# EasyEDA schematic SCH_wordclocksmall_2023-02-03.json
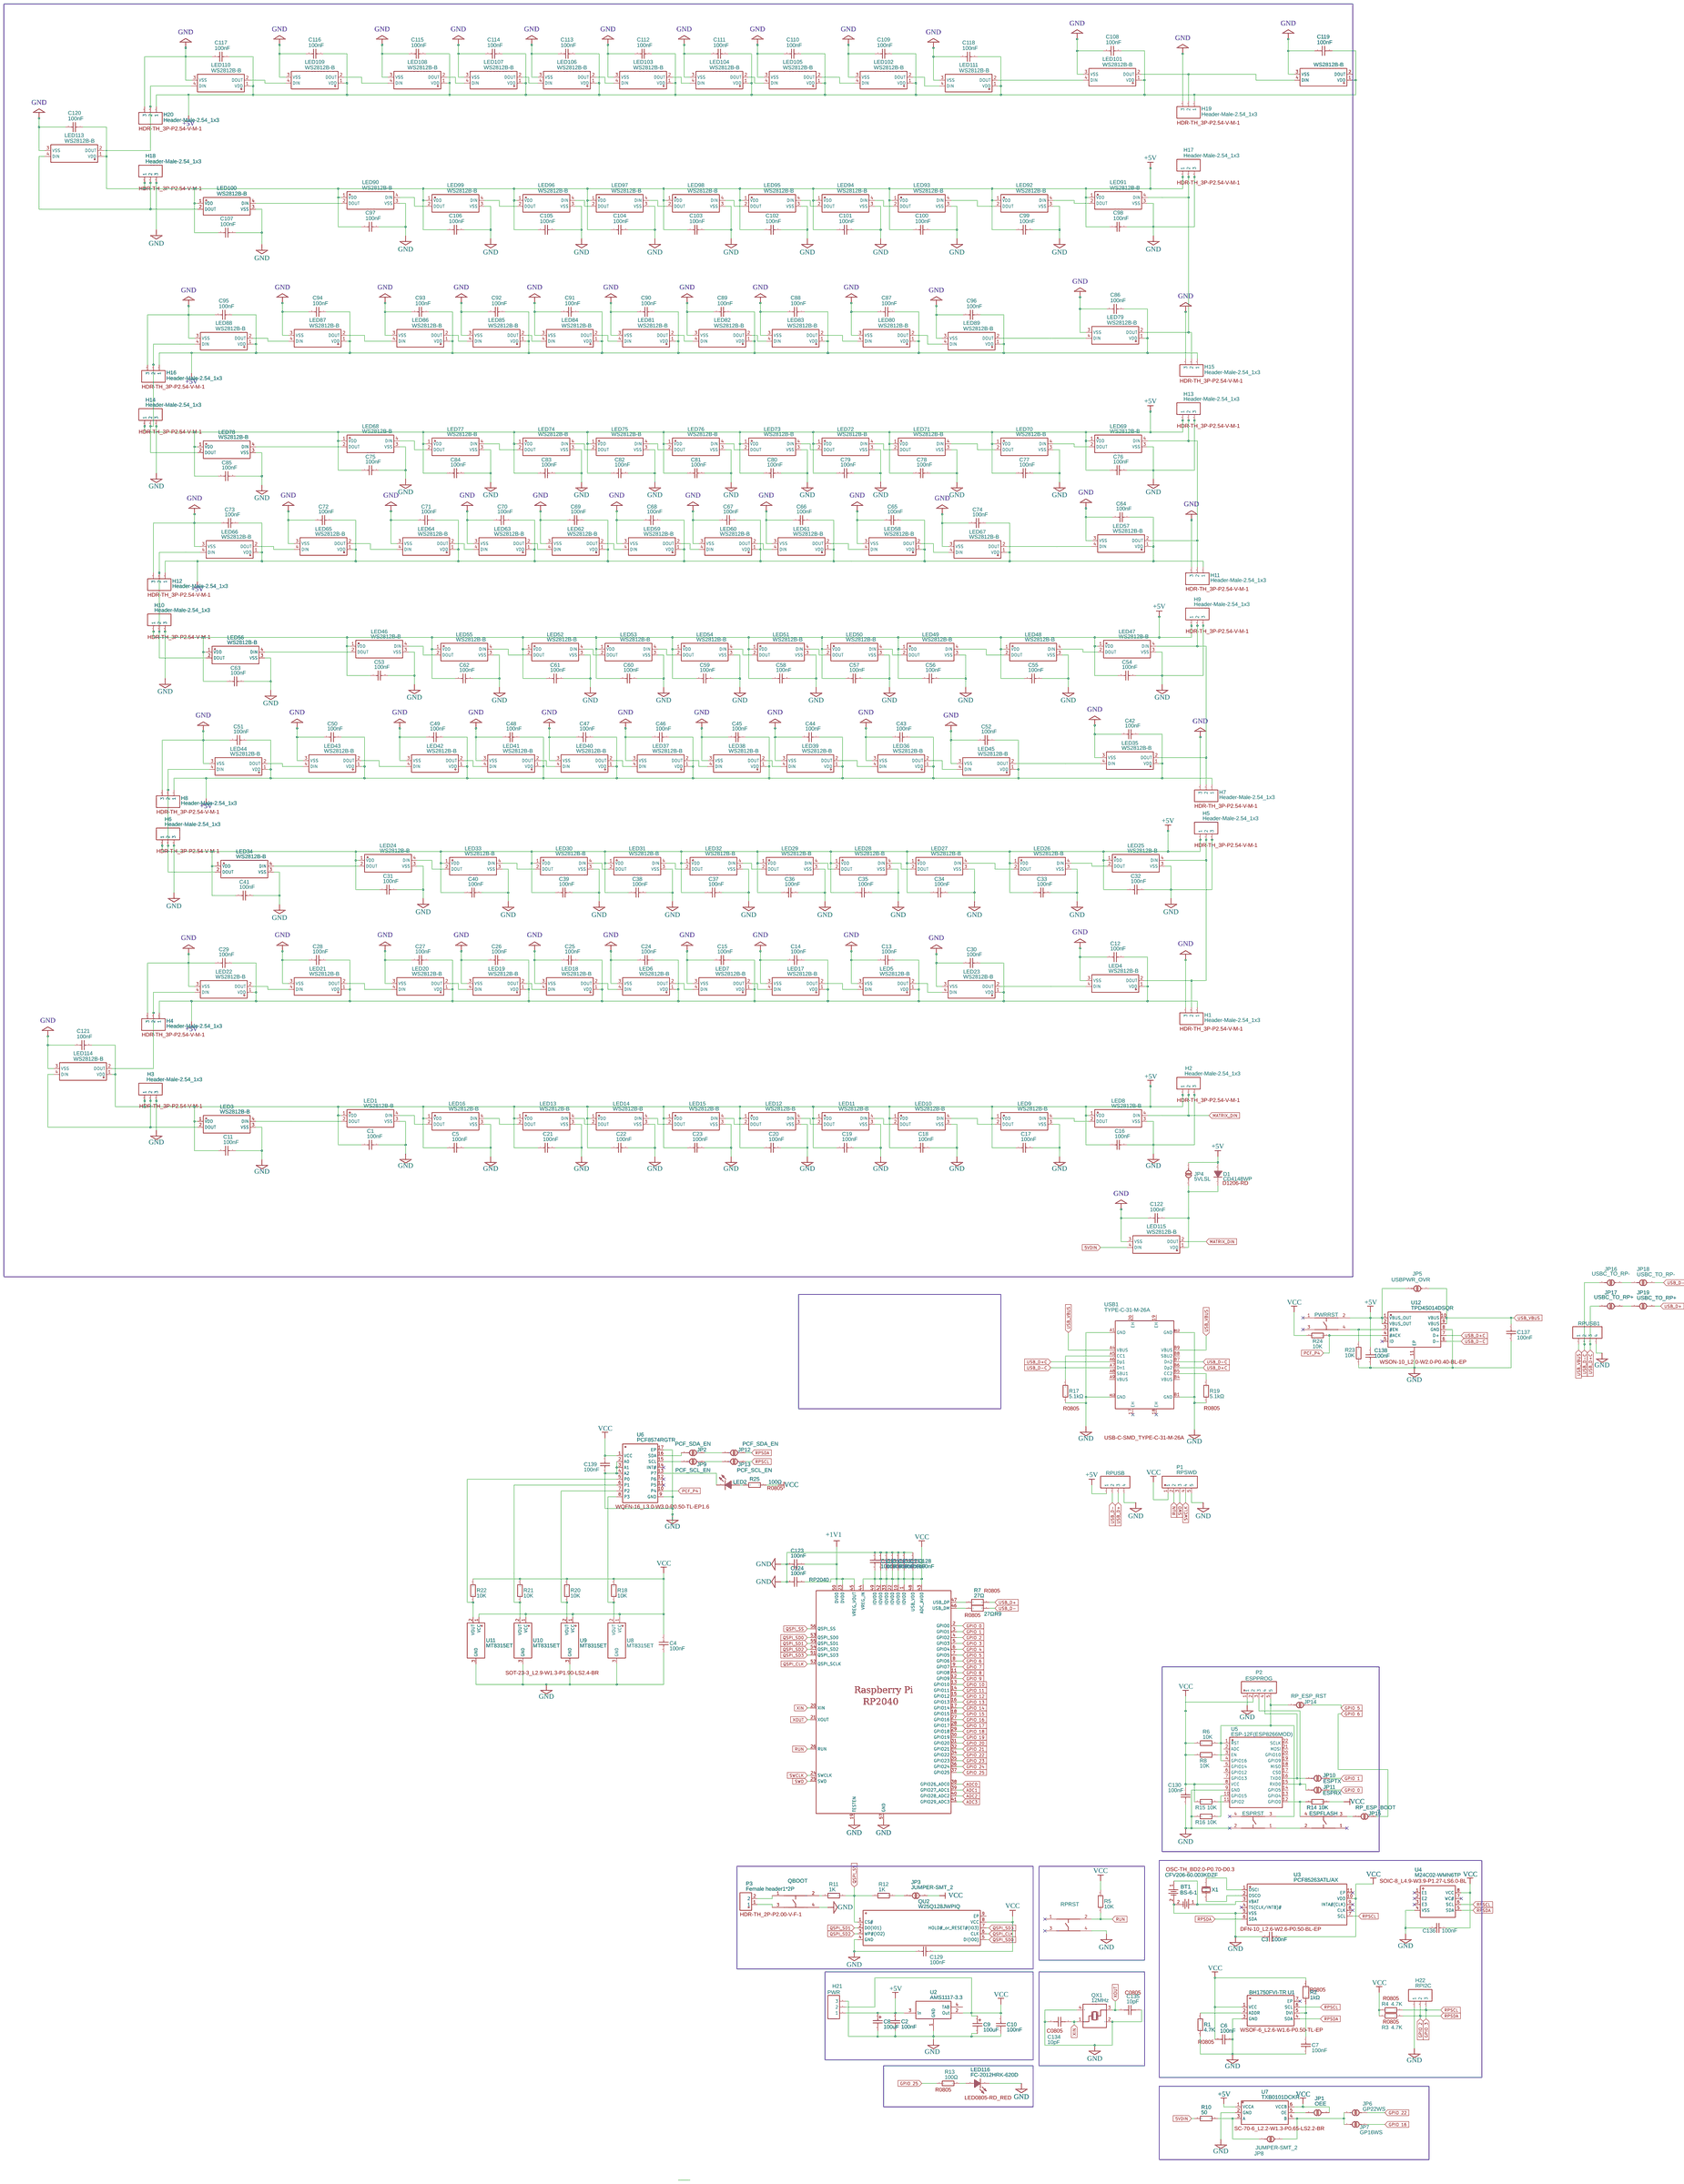
[diagram p0: schematic sheet]

## Parts
BT1  BS-6-1  [BAT-SMD_BS-6-1]
BT2  BS-6-1  [BAT-SMD_BS-6-1]
C1  100nF  [0805]
C2  100nF  [0805]
C3  100nF  [0805]
C4  100nF  [0805]
C5  100nF  [0805]
C6  100nF  [0805]
C7  100nF  [0805]
C8  100uF  [CAP-SMD_L3.5-W2.8]
C9  100uF  [CAP-SMD_L3.5-W2.8]
C10  100nF  [0805]
C11  100nF  [0805]
C12  100nF  [0805]
C13  100nF  [0805]
C14  100nF  [0805]
C15  100nF  [0805]
C16  100nF  [0805]
C17  100nF  [0805]
C18  100nF  [0805]
C19  100nF  [0805]
C20  100nF  [0805]
C21  100nF  [0805]
C22  100nF  [0805]
C23  100nF  [0805]
C24  100nF  [0805]
C25  100nF  [0805]
C26  100nF  [0805]
C27  100nF  [0805]
C28  100nF  [0805]
C29  100nF  [0805]
C30  100nF  [0805]
C31  100nF  [0805]
C32  100nF  [0805]
C33  100nF  [0805]
C34  100nF  [0805]
C35  100nF  [0805]
C36  100nF  [0805]
C37  100nF  [0805]
C38  100nF  [0805]
C39  100nF  [0805]
C40  100nF  [0805]
C41  100nF  [0805]
C42  100nF  [0805]
C43  100nF  [0805]
C44  100nF  [0805]
C45  100nF  [0805]
C46  100nF  [0805]
C47  100nF  [0805]
C48  100nF  [0805]
C49  100nF  [0805]
C50  100nF  [0805]
C51  100nF  [0805]
C52  100nF  [0805]
C53  100nF  [0805]
C54  100nF  [0805]
C55  100nF  [0805]
C56  100nF  [0805]
C57  100nF  [0805]
C58  100nF  [0805]
C59  100nF  [0805]
C60  100nF  [0805]
C61  100nF  [0805]
C62  100nF  [0805]
C63  100nF  [0805]
C64  100nF  [0805]
C65  100nF  [0805]
C66  100nF  [0805]
C67  100nF  [0805]
C68  100nF  [0805]
C69  100nF  [0805]
C70  100nF  [0805]
C71  100nF  [0805]
C72  100nF  [0805]
C73  100nF  [0805]
C74  100nF  [0805]
C75  100nF  [0805]
C76  100nF  [0805]
C77  100nF  [0805]
C78  100nF  [0805]
C79  100nF  [0805]
C80  100nF  [0805]
C81  100nF  [0805]
C82  100nF  [0805]
C83  100nF  [0805]
C84  100nF  [0805]
C85  100nF  [0805]
C86  100nF  [0805]
C87  100nF  [0805]
C88  100nF  [0805]
C89  100nF  [0805]
C90  100nF  [0805]
C91  100nF  [0805]
C92  100nF  [0805]
C93  100nF  [0805]
C94  100nF  [0805]
C95  100nF  [0805]
C96  100nF  [0805]
C97  100nF  [0805]
C98  100nF  [0805]
C99  100nF  [0805]
C100  100nF  [0805]
C101  100nF  [0805]
C102  100nF  [0805]
C103  100nF  [0805]
C104  100nF  [0805]
C105  100nF  [0805]
C106  100nF  [0805]
C107  100nF  [0805]
C108  100nF  [0805]
C109  100nF  [0805]
C110  100nF  [0805]
C111  100nF  [0805]
C112  100nF  [0805]
C113  100nF  [0805]
C114  100nF  [0805]
C115  100nF  [0805]
C116  100nF  [0805]
C117  100nF  [0805]
C118  100nF  [0805]
C119  100nF  [0805]
C120  100nF  [0805]
C121  100nF  [0805]
C122  100nF  [0805]
C123  100nF  [0805]
C124  100nF  [0805]
C125  100nF  [0805]
C126  100nF  [0805]
C127  100nF  [0805]
C128  100nF  [0805]
C129  100nF  [0805]
C130  100nF  [0805]
C131  100nF  [0805]
C132  100nF  [0805]
C133  100nF  [0805]
C134  10pF  [C0805]
C135  10pF  [C0805]
C136  100nF  [0805]
C137  100nF  [0805]
C138  100nF  [0805]
C139  100nF  [0805]
D1  CD4148WP  [D1206-RD]
ESPFLASH  PTS810SJM250SMTRLFS  [KEY-SMD_4P-L4.2-W3.2-P2.20-LS4.6]
ESPRST  PTS810SJM250SMTRLFS  [KEY-SMD_4P-L4.2-W3.2-P2.20-LS4.6]
H1  Header-Male-2.54_1x3  [HDR-TH_3P-P2.54-V-M-1]
H2  Header-Male-2.54_1x3  [HDR-TH_3P-P2.54-V-M-1]
H3  Header-Male-2.54_1x3  [HDR-TH_3P-P2.54-V-M-1]
H4  Header-Male-2.54_1x3  [HDR-TH_3P-P2.54-V-M-1]
H5  Header-Male-2.54_1x3  [HDR-TH_3P-P2.54-V-M-1]
H6  Header-Male-2.54_1x3  [HDR-TH_3P-P2.54-V-M-1]
H7  Header-Male-2.54_1x3  [HDR-TH_3P-P2.54-V-M-1]
H8  Header-Male-2.54_1x3  [HDR-TH_3P-P2.54-V-M-1]
H9  Header-Male-2.54_1x3  [HDR-TH_3P-P2.54-V-M-1]
H10  Header-Male-2.54_1x3  [HDR-TH_3P-P2.54-V-M-1]
H11  Header-Male-2.54_1x3  [HDR-TH_3P-P2.54-V-M-1]
H12  Header-Male-2.54_1x3  [HDR-TH_3P-P2.54-V-M-1]
H13  Header-Male-2.54_1x3  [HDR-TH_3P-P2.54-V-M-1]
H14  Header-Male-2.54_1x3  [HDR-TH_3P-P2.54-V-M-1]
H15  Header-Male-2.54_1x3  [HDR-TH_3P-P2.54-V-M-1]
H16  Header-Male-2.54_1x3  [HDR-TH_3P-P2.54-V-M-1]
H17  Header-Male-2.54_1x3  [HDR-TH_3P-P2.54-V-M-1]
H18  Header-Male-2.54_1x3  [HDR-TH_3P-P2.54-V-M-1]
H19  Header-Male-2.54_1x3  [HDR-TH_3P-P2.54-V-M-1]
H20  Header-Male-2.54_1x3  [HDR-TH_3P-P2.54-V-M-1]
H21  PWR  [HDR-TH_3P-P2.54-V-M-1]
H22  RPI2C  [HDR-TH_3P-P2.54-V-M-1]
JP1  OEE  [JUMPERS_SMT-JUMPER_2_NC_PASTE_NO-SILK]
JP2  PCF_SDA_EN  [JUMPERS_SMT-JUMPER_2_NC_PASTE_NO-SILK]
JP3  JUMPER-SMT_2  [JUMPERS_SMT-JUMPER_2_NC_PASTE_NO-SILK]
JP4  5VLSL  [JUMPERS_SMT-JUMPER_2_NC_PASTE_NO-SILK]
JP5  USBPWR_OVR  [JUMPERS_SMT-JUMPER_2_NC_PASTE_NO-SILK]
JP6  GP22WS  [JUMPERS_SMT-JUMPER_2_NC_PASTE_NO-SILK]
JP7  GP16WS  [JUMPERS_SMT-JUMPER_2_NC_PASTE_NO-SILK]
JP8  JUMPER-SMT_2  [JUMPERS_SMT-JUMPER_2_NC_PASTE_NO-SILK]
JP9  PCF_SCL_EN  [JUMPERS_SMT-JUMPER_2_NC_PASTE_NO-SILK]
JP10  ESPTX  [JUMPERS_SMT-JUMPER_2_NC_PASTE_NO-SILK]
JP11  ESPRX  [JUMPERS_SMT-JUMPER_2_NC_PASTE_NO-SILK]
JP12  PCF_SDA_EN  [JUMPERS_SMT-JUMPER_2_NC_PASTE_NO-SILK]
JP13  PCF_SCL_EN  [JUMPERS_SMT-JUMPER_2_NC_PASTE_NO-SILK]
JP14  RP_ESP_RST  [JUMPERS_SMT-JUMPER_2_NC_PASTE_NO-SILK]
JP15  RP_ESP_BOOT  [JUMPERS_SMT-JUMPER_2_NC_PASTE_NO-SILK]
JP16  USBC_TO_RP-  [JUMPERS_SMT-JUMPER_2_NC_PASTE_NO-SILK]
JP17  USBC_TO_RP+  [JUMPERS_SMT-JUMPER_2_NC_PASTE_NO-SILK]
JP18  USBC_TO_RP-  [JUMPERS_SMT-JUMPER_2_NC_PASTE_NO-SILK]
JP19  USBC_TO_RP+  [JUMPERS_SMT-JUMPER_2_NC_PASTE_NO-SILK]
LED1  WS2812B-B  [LED-5050_4P]
LED2  FC-2012HRK-620D  [LED0805-RD_RED]
LED3  WS2812B-B  [LED-5050_4P]
LED4  WS2812B-B  [LED-5050_4P]
LED5  WS2812B-B  [LED-5050_4P]
LED6  WS2812B-B  [LED-5050_4P]
LED7  WS2812B-B  [LED-5050_4P]
LED8  WS2812B-B  [LED-5050_4P]
LED9  WS2812B-B  [LED-5050_4P]
LED10  WS2812B-B  [LED-5050_4P]
LED11  WS2812B-B  [LED-5050_4P]
LED12  WS2812B-B  [LED-5050_4P]
LED13  WS2812B-B  [LED-5050_4P]
LED14  WS2812B-B  [LED-5050_4P]
LED15  WS2812B-B  [LED-5050_4P]
LED16  WS2812B-B  [LED-5050_4P]
LED17  WS2812B-B  [LED-5050_4P]
LED18  WS2812B-B  [LED-5050_4P]
LED19  WS2812B-B  [LED-5050_4P]
LED20  WS2812B-B  [LED-5050_4P]
LED21  WS2812B-B  [LED-5050_4P]
LED22  WS2812B-B  [LED-5050_4P]
LED23  WS2812B-B  [LED-5050_4P]
LED24  WS2812B-B  [LED-5050_4P]
LED25  WS2812B-B  [LED-5050_4P]
LED26  WS2812B-B  [LED-5050_4P]
LED27  WS2812B-B  [LED-5050_4P]
LED28  WS2812B-B  [LED-5050_4P]
LED29  WS2812B-B  [LED-5050_4P]
LED30  WS2812B-B  [LED-5050_4P]
LED31  WS2812B-B  [LED-5050_4P]
LED32  WS2812B-B  [LED-5050_4P]
LED33  WS2812B-B  [LED-5050_4P]
LED34  WS2812B-B  [LED-5050_4P]
LED35  WS2812B-B  [LED-5050_4P]
LED36  WS2812B-B  [LED-5050_4P]
LED37  WS2812B-B  [LED-5050_4P]
LED38  WS2812B-B  [LED-5050_4P]
LED39  WS2812B-B  [LED-5050_4P]
LED40  WS2812B-B  [LED-5050_4P]
LED41  WS2812B-B  [LED-5050_4P]
LED42  WS2812B-B  [LED-5050_4P]
LED43  WS2812B-B  [LED-5050_4P]
LED44  WS2812B-B  [LED-5050_4P]
LED45  WS2812B-B  [LED-5050_4P]
LED46  WS2812B-B  [LED-5050_4P]
LED47  WS2812B-B  [LED-5050_4P]
LED48  WS2812B-B  [LED-5050_4P]
LED49  WS2812B-B  [LED-5050_4P]
LED50  WS2812B-B  [LED-5050_4P]
LED51  WS2812B-B  [LED-5050_4P]
LED52  WS2812B-B  [LED-5050_4P]
LED53  WS2812B-B  [LED-5050_4P]
LED54  WS2812B-B  [LED-5050_4P]
LED55  WS2812B-B  [LED-5050_4P]
LED56  WS2812B-B  [LED-5050_4P]
LED57  WS2812B-B  [LED-5050_4P]
LED58  WS2812B-B  [LED-5050_4P]
LED59  WS2812B-B  [LED-5050_4P]
LED60  WS2812B-B  [LED-5050_4P]
LED61  WS2812B-B  [LED-5050_4P]
LED62  WS2812B-B  [LED-5050_4P]
LED63  WS2812B-B  [LED-5050_4P]
LED64  WS2812B-B  [LED-5050_4P]
LED65  WS2812B-B  [LED-5050_4P]
LED66  WS2812B-B  [LED-5050_4P]
LED67  WS2812B-B  [LED-5050_4P]
LED68  WS2812B-B  [LED-5050_4P]
LED69  WS2812B-B  [LED-5050_4P]
LED70  WS2812B-B  [LED-5050_4P]
LED71  WS2812B-B  [LED-5050_4P]
LED72  WS2812B-B  [LED-5050_4P]
LED73  WS2812B-B  [LED-5050_4P]
LED74  WS2812B-B  [LED-5050_4P]
LED75  WS2812B-B  [LED-5050_4P]
LED76  WS2812B-B  [LED-5050_4P]
LED77  WS2812B-B  [LED-5050_4P]
LED78  WS2812B-B  [LED-5050_4P]
LED79  WS2812B-B  [LED-5050_4P]
LED80  WS2812B-B  [LED-5050_4P]
LED81  WS2812B-B  [LED-5050_4P]
LED82  WS2812B-B  [LED-5050_4P]
LED83  WS2812B-B  [LED-5050_4P]
LED84  WS2812B-B  [LED-5050_4P]
LED85  WS2812B-B  [LED-5050_4P]
LED86  WS2812B-B  [LED-5050_4P]
LED87  WS2812B-B  [LED-5050_4P]
LED88  WS2812B-B  [LED-5050_4P]
LED89  WS2812B-B  [LED-5050_4P]
LED90  WS2812B-B  [LED-5050_4P]
LED91  WS2812B-B  [LED-5050_4P]
LED92  WS2812B-B  [LED-5050_4P]
LED93  WS2812B-B  [LED-5050_4P]
LED94  WS2812B-B  [LED-5050_4P]
LED95  WS2812B-B  [LED-5050_4P]
LED96  WS2812B-B  [LED-5050_4P]
LED97  WS2812B-B  [LED-5050_4P]
LED98  WS2812B-B  [LED-5050_4P]
LED99  WS2812B-B  [LED-5050_4P]
LED100  WS2812B-B  [LED-5050_4P]
LED101  WS2812B-B  [LED-5050_4P]
LED102  WS2812B-B  [LED-5050_4P]
LED103  WS2812B-B  [LED-5050_4P]
LED104  WS2812B-B  [LED-5050_4P]
LED105  WS2812B-B  [LED-5050_4P]
LED106  WS2812B-B  [LED-5050_4P]
LED107  WS2812B-B  [LED-5050_4P]
LED108  WS2812B-B  [LED-5050_4P]
LED109  WS2812B-B  [LED-5050_4P]
LED110  WS2812B-B  [LED-5050_4P]
LED111  WS2812B-B  [LED-5050_4P]
LED112  WS2812B-B  [LED-5050_4P]
LED113  WS2812B-B  [LED-5050_4P]
LED114  WS2812B-B  [LED-5050_4P]
LED115  WS2812B-B  [LED-5050_4P]
LED116  FC-2012HRK-620D  [LED0805-RD_RED]
P1  RPSWD  [HDR-TH_5P-P2.00-V-F-1]
P2  ESPPROG  [HDR-TH_5P-P2.00-V-F-1]
P3  Female header1*2P  [HDR-TH_2P-P2.00-V-F-1]
PWRRST  PTS810SJM250SMTRLFS  [KEY-SMD_4P-L4.2-W3.2-P2.20-LS4.6]
QBOOT  PTS810SJM250SMTRLFS  [KEY-SMD_4P-L4.2-W3.2-P2.20-LS4.6]
QU1  RP2040  [LQFN-56_L7.0-W7.0-P0.4-EP]
QU2  W25Q128JWPIQ  [WSON-8_L6.0-W5.0-P1.27-BL-EP]
QX1  12MHz  [CRYSTAL-SMD_4P-L3.2-W2.5-BL]
R1  4.7K  [R0805]
R2  1kΩ  [R0805]
R3  4.7K  [R0805]
R4  4.7K  [R0805]
R5  10K  [0805]
R6  10K  [0805]
R7  27Ω  [R0805]
R8  10K  [0805]
R9  27Ω  [R0805]
R10  50  [0805]
R11  1K  [0805]
R12  1K  [0805]
R13  100Ω  [R0805]
R14  10K  [0805]
R15  10K  [0805]
R16  10K  [0805]
R17  5.1kΩ  [R0805]
R18  10K  [0805]
R19  5.1kΩ  [R0805]
R20  10K  [0805]
R21  10K  [0805]
R22  10K  [0805]
R23  10K  [0805]
R24  10K  [0805]
R25  100Ω  [R0805]
RPRST  PTS810SJM250SMTRLFS  [KEY-SMD_4P-L4.2-W3.2-P2.20-LS4.6]
RPUSB  HDR-M-2.54_1x4  [HDR-M-2.54_1X4]
RPUSB1  HDR-M-2.54_1x4  [HDR-M-2.54_1X4]
U1  BH1750FVI-TR  [WSOF-6_L2.6-W1.6-P0.50-TL-EP]
U2  AMS1117-3.3  [SOT-223_L6.5-W3.5-P2.30-LS7.0-BR]
U3  PCF85263ATL/AX  [DFN-10_L2.6-W2.6-P0.50-BL-EP]
U4  M24C02-WMN6TP  [SOIC-8_L4.9-W3.9-P1.27-LS6.0-BL]
U5  ESP-12F(ESP8266MOD)  [WIFIM-SMD_ESP-12F-ESP8266MOD]
U6  PCF8574RGTR  [WQFN-16_L3.0-W3.0-P0.50-TL-EP1.6]
U7  TXB0101DCKR  [SC-70-6_L2.2-W1.3-P0.65-LS2.2-BR]
U8  MT8315ET  [SOT-23-3_L2.9-W1.3-P1.90-LS2.4-BR]
U9  MT8315ET  [SOT-23-3_L2.9-W1.3-P1.90-LS2.4-BR]
U10  MT8315ET  [SOT-23-3_L2.9-W1.3-P1.90-LS2.4-BR]
U11  MT8315ET  [SOT-23-3_L2.9-W1.3-P1.90-LS2.4-BR]
U12  TPD4S014DSQR  [WSON-10_L2.0-W2.0-P0.40-BL-EP]
USB1  TYPE-C-31-M-26A  [USB-C-SMD_TYPE-C-31-M-26A]
X1  CFV206-60.003KDZF  [OSC-TH_BD2.0-P0.70-D0.3]

## Library data of the parts
BT1 BT2 = BS-6-1: Supplier: LCSC; Supplier Part: C969909; Manufacturer: Q&J; Contributor: LCSC; JLCPCB Part Class: Extended Part; Package Display: No
C1-C7 C10-C133 C136-C139 = CC0805KRX7R9BB104: Supplier: LCSC; Manufacturer: YAGEO; LCSC Assembly: Yes; Supplier Part: C49678; SMT Type: Basic
C8 C9 = TAJB107K006RNJ: Supplier: LCSC; Manufacturer: AVX; LCSC Assembly: Yes; Supplier Part: C16133; SMT Type: Basic
C134 = CC0805JRNPOYBN100: Supplier: LCSC; Supplier Part: C1785; Manufacturer: YAGEO; Manufacturer Part: CL21C100JBANNNC; Contributor: LCSC; JLCPCB Part Class: Extended Part; Package Display: Yes
C135 = CC0805JRNPOYBN100: Supplier: LCSC; Supplier Part: C1785; Manufacturer: YAGEO; Manufacturer Part: CL21C100JBANNNC; Contributor: LCSC; JLCPCB Part Class: Basic Part; Package Display: Yes
D1 = CD4148WP: Supplier: LCSC; Manufacturer: LIZ; Supplier Part: C109000; JLCPCB Part Class: Extended Part; Package Display: Yes
ESPFLASH ESPRST PWRRST QBOOT RPRST = PTS810SJM250SMTRLFS: Supplier: LCSC; Supplier Part: C116501; Manufacturer: C&K; Contributor: LCSC; JLCPCB Part Class: Extended Part
H1-H20 = Header-Male-2.54_1x3: Supplier: LCSC; Manufacturer: BOOMELE; Manufacturer Part: Header2.54mm 1*3P; Supplier Part: C49257; JLCPCB Part Class: Extended Part; Package Display: Yes
H21 H22 = Header-Male-2.54_1x3: Supplier: LCSC; Manufacturer: BOOMELE; Manufacturer Part: Header2.54mm 1*3P; Supplier Part: C49257; JLCPCB Part Class: Extended Part; Package Display: No
JP1-JP19 = JUMPER-SMT_2: Contributor: Celeron; Package Display: No
LED1 LED3-LED115 = -: Supplier: LCSC; Manufacturer: Worldsemi; Contributor: LCSC; Supplier Part: C114586
LED2 = FC-2012HRK-620D: Supplier: LCSC; Manufacturer: NATIONSTAR; Supplier Part: C84256; JLCPCB Part Class: Basic Part; Package Display: No
LED116 = FC-2012HRK-620D: Supplier: LCSC; Manufacturer: NATIONSTAR; Supplier Part: C84256; JLCPCB Part Class: Basic Part; Package Display: Yes
P1 P2 = Female header1*5P: Supplier: LCSC; Manufacturer: BOOMELE; Supplier Part: C66508; JLCPCB Part Class: Extended Part; Package Display: No
P3 = Female header1*2P: Supplier: LCSC; Manufacturer: BOOMELE; Supplier Part: C66509; JLCPCB Part Class: Extended Part; Package Display: Yes
QU1 = RP2040: Supplier: LCSC; Supplier Part: C2040; Manufacturer: Raspberry Pi(树莓派); JLCPCB Part Class: Extended Part; Contributor: LCSC
QU2 = W25Q128JWPIQ: Supplier: LCSC; Supplier Part: C2689660; Manufacturer: WINBOND(华邦); Contributor: LCSC; JLCPCB Part Class: Extended Part
QX1 = SMD-3225_4P12M12PF10PPM: Supplier: LCSC; Manufacturer: YXC; Manufacturer Part: X322512MSB4SI; Contributor: LCSC; Supplier Part: C9002; JLCPCB Part Class: Basic Part
R1 R3 R4 = CR0805F4K7P05: Supplier: LCSC; Supplier Part: C17673; Manufacturer: UniOhm; Manufacturer Part: 0805W8F4701T5E; Contributor: LCSC; JLCPCB Part Class: Basic Part; Package Display: Yes
R2 = PTFR0805D1K00P9: Supplier: LCSC; Supplier Part: C17513; Manufacturer: UniOhm; Manufacturer Part: 0805W8F1001T5E; Resistance (Ohms): 1K; Contributor: LCSC; JLCPCB Part Class: Basic Part; Package Display: Yes
R5 R6 R8 R10 R14-R16 R18 R20-R24 = 0805W8F1002T5E: Supplier: LCSC; Manufacturer: UniOhm; LCSC Assembly: Yes; Supplier Part: C17414; SMT Type: Basic
R7 R9 = CR0805F24RP05: Supplier: LCSC; Supplier Part: C17594; Manufacturer: Ever Ohms Tech; Manufacturer Part: 0805W8F270JT5E; Resistance (Ohms): 27; Contributor: LCSC; JLCPCB Part Class: Basic Part; Package Display: Yes
R11 R12 = 0805W8F1002T5E: Supplier: LCSC; Manufacturer: UniOhm; Manufacturer Part: 0805W8F1001T5E; LCSC Assembly: Yes; Supplier Part: C17513; SMT Type: Basic
R13 R25 = PTFR0805B100RN9: Supplier: LCSC; Supplier Part: C17408; Manufacturer: UniOhm; Manufacturer Part: 0805W8F1000T5E; Resistance (Ohms): 100; Contributor: LCSC; JLCPCB Part Class: Extended Part; Package Display: Yes
R17 R19 = 0805W8F5101T5E: Supplier: LCSC; Manufacturer: UNI-ROYAL(厚声); Supplier Part: C27834; Resistance (Ohms): 5.1K; JLCPCB Part Class: Basic Part; Package Display: Yes
RPUSB RPUSB1 = HDR-M-2.54_1x4: Supplier Part: C124378; Supplier: LCSC; Contributor: LCEDA_Lib
U1 = BH1750FVI-TR: Supplier: LCSC; Manufacturer: ROHM; Supplier Part: C78960; JLCPCB Part Class: Extended Part; Package Display: Yes
U2 = -: sourceId: dwIGgezVh; Supplier: LCSC; Manufacturer: AMS; LCSC Assembly: Yes; image: //image.lceda.cn/szlcsc/C6186.jpg; Supplier Part: C6186; SMT Type: Basic
U3 = PCF85263ATL/AX: Supplier: LCSC; Supplier Part: C2651523; Manufacturer: NXP(恩智浦); JLCPCB Part Class: Extended Part; Contributor: LCSC; Package Display: Yes
U4 = M24C02-WMN6TP: Supplier: LCSC; Manufacturer: ST(意法半导体); Supplier Part: C7562; JLCPCB Part Class: Basic Part; Package Display: Yes
U5 = ESP-12F(ESP8266MOD): Supplier: LCSC; Manufacturer: Ai-Thinker(安信可); Supplier Part: C82891; JLCPCB Part Class: Extended Part; Package Display: No
U6 = PCF8574RGTR: Supplier: LCSC; Supplier Part: C2652270; Manufacturer: TI(德州仪器); Contributor: LCSC; Package Display: Yes
U7 = TXB0101DCKR: Supplier: LCSC; Supplier Part: C324081; Manufacturer: Texas Instruments; Contributor: LCSC; JLCPCB Part Class: Extended Part; Package Display: Yes
U8 U9 U11 = MT8315ET: Supplier: LCSC; Supplier Part: C879584; Manufacturer: MagnTek(麦歌恩); Contributor: LCSC; JLCPCB Part Class: Extended Part; Package Display: No
U10 = MT8315ET: Supplier: LCSC; Supplier Part: C879584; Manufacturer: MagnTek(麦歌恩); Contributor: LCSC; JLCPCB Part Class: Extended Part; Package Display: Yes
U12 = TPD4S014DSQR: Supplier: LCSC; Supplier Part: C202244; Manufacturer: TI(德州仪器); Contributor: LCSC; JLCPCB Part Class: Extended Part; Package Display: Yes
USB1 = TYPE-C-31-M-26A: Supplier: LCSC; Supplier Part: C2848621; Manufacturer: 韩国韩荣; Contributor: LCSC; JLCPCB Part Class: Extended Part; Package Display: Yes
X1 = CFV206-60.003KDZF: Supplier: LCSC; Supplier Part: C389957; Manufacturer: CITIZEN; Contributor: LCSC; JLCPCB Part Class: Extended Part; Package Display: Yes

## Nets
5VDIN: LED115.4(DIN) R10.1
+1V1: C123.1 C124.1 QU1.23(DVDD) QU1.45(VREG_VOUT) QU1.50(DVDD)
+5V: C1.1 C2.2 C5.1 C8.1 C11.1 C12.1 C13.1 C14.1 C15.1 C16.1 C17.1 C18.1 C19.1 C20.1 C21.1 C22.1 C23.1 C24.1 C25.1 C26.1 C27.1 C28.1 C29.1 C30.1 C31.1 C32.1 C33.1 C34.1 C35.1 C36.1 C37.1 C38.1 C39.1 C40.1 C41.1 C42.1 C43.1 C44.1 C45.1 C46.1 C47.1 C48.1 C49.1 C50.1 C51.1 C52.1 C53.1 C54.1 C55.1 C56.1 C57.1 C58.1 C59.1 C60.1 C61.1 C62.1 C63.1 C64.1 C65.1 C66.1 C67.1 C68.1 C69.1 C70.1 C71.1 C72.1 C73.1 C74.1 C75.1 C76.1 C77.1 C78.1 C79.1 C80.1 C81.1 C82.1 C83.1 C84.1 C85.1 C86.1 C87.1 C88.1 C89.1 C90.1 C91.1 C92.1 C93.1 C94.1 C95.1 C96.1 C97.1 C98.1 C99.1 C100.1 C101.1 C102.1 C103.1 C104.1 C105.1 C106.1 C107.1 C108.1 C109.1 C110.1 C111.1 C112.1 C113.1 C114.1 C115.1 C116.1 C117.1 C118.1 C119.1 C120.1 C121.1 C138.1 D1.2(A) H1.1 H2.1 H3.1 H4.1 H5.1 H6.1 H7.1 H8.1 H9.1 H10.1 H11.1 H12.1 H13.1 H14.1 H15.1 H16.1 H17.1 H18.1 H19.1 H20.1 H21.1 JP4.1 JP5.1 LED1.1(VDD) LED3.1(VDD) LED4.1(VDD) LED5.1(VDD) LED6.1(VDD) LED7.1(VDD) LED8.1(VDD) LED9.1(VDD) LED10.1(VDD) LED11.1(VDD) LED12.1(VDD) LED13.1(VDD) LED14.1(VDD) LED15.1(VDD) LED16.1(VDD) LED17.1(VDD) LED18.1(VDD) LED19.1(VDD) LED20.1(VDD) LED21.1(VDD) LED22.1(VDD) LED23.1(VDD) LED24.1(VDD) LED25.1(VDD) LED26.1(VDD) LED27.1(VDD) LED28.1(VDD) LED29.1(VDD) LED30.1(VDD) LED31.1(VDD) LED32.1(VDD) LED33.1(VDD) LED34.1(VDD) LED35.1(VDD) LED36.1(VDD) LED37.1(VDD) LED38.1(VDD) LED39.1(VDD) LED40.1(VDD) LED41.1(VDD) LED42.1(VDD) LED43.1(VDD) LED44.1(VDD) LED45.1(VDD) LED46.1(VDD) LED47.1(VDD) LED48.1(VDD) LED49.1(VDD) LED50.1(VDD) LED51.1(VDD) LED52.1(VDD) LED53.1(VDD) LED54.1(VDD) LED55.1(VDD) LED56.1(VDD) LED57.1(VDD) LED58.1(VDD) LED59.1(VDD) LED60.1(VDD) LED61.1(VDD) LED62.1(VDD) LED63.1(VDD) LED64.1(VDD) LED65.1(VDD) LED66.1(VDD) LED67.1(VDD) LED68.1(VDD) LED69.1(VDD) LED70.1(VDD) LED71.1(VDD) LED72.1(VDD) LED73.1(VDD) LED74.1(VDD) LED75.1(VDD) LED76.1(VDD) LED77.1(VDD) LED78.1(VDD) LED79.1(VDD) LED80.1(VDD) LED81.1(VDD) LED82.1(VDD) LED83.1(VDD) LED84.1(VDD) LED85.1(VDD) LED86.1(VDD) LED87.1(VDD) LED88.1(VDD) LED89.1(VDD) LED90.1(VDD) LED91.1(VDD) LED92.1(VDD) LED93.1(VDD) LED94.1(VDD) LED95.1(VDD) LED96.1(VDD) LED97.1(VDD) LED98.1(VDD) LED99.1(VDD) LED100.1(VDD) LED101.1(VDD) LED102.1(VDD) LED103.1(VDD) LED104.1(VDD) LED105.1(VDD) LED106.1(VDD) LED107.1(VDD) LED108.1(VDD) LED109.1(VDD) LED110.1(VDD) LED111.1(VDD) LED112.1(VDD) LED113.1(VDD) LED114.1(VDD) PWRRST.2 RPUSB.1 U2.3(In) U7.1(VCCA) U12.1(VBUS_OUT) U12.2(VBUS_OUT)
GND: BT1.2 BT2.2 C1.2 C2.1 C3.2 C4.2 C5.2 C6.1 C7.2 C8.2 C9.2 C10.1 C11.2 C12.2 C13.2 C14.2 C15.2 C16.2 C17.2 C18.2 C19.2 C20.2 C21.2 C22.2 C23.2 C24.2 C25.2 C26.2 C27.2 C28.2 C29.2 C30.2 C31.2 C32.2 C33.2 C34.2 C35.2 C36.2 C37.2 C38.2 C39.2 C40.2 C41.2 C42.2 C43.2 C44.2 C45.2 C46.2 C47.2 C48.2 C49.2 C50.2 C51.2 C52.2 C53.2 C54.2 C55.2 C56.2 C57.2 C58.2 C59.2 C60.2 C61.2 C62.2 C63.2 C64.2 C65.2 C66.2 C67.2 C68.2 C69.2 C70.2 C71.2 C72.2 C73.2 C74.2 C75.2 C76.2 C77.2 C78.2 C79.2 C80.2 C81.2 C82.2 C83.2 C84.2 C85.2 C86.2 C87.2 C88.2 C89.2 C90.2 C91.2 C92.2 C93.2 C94.2 C95.2 C96.2 C97.2 C98.2 C99.2 C100.2 C101.2 C102.2 C103.2 C104.2 C105.2 C106.2 C107.2 C108.2 C109.2 C110.2 C111.2 C112.2 C113.2 C114.2 C115.2 C116.2 C117.2 C118.2 C119.2 C120.2 C121.2 C122.2 C123.2 C124.2 C125.1 C126.1 C127.1 C128.1 C129.2 C130.2 C131.1 C132.1 C133.1 C134.2 C135.1 C136.2 C137.2 C138.2 C139.1 ESPRST.2 H1.3 H2.3 H3.3 H4.3 H5.3 H6.3 H7.3 H8.3 H9.3 H10.3 H11.3 H12.3 H13.3 H14.3 H15.3 H16.3 H17.3 H18.3 H19.3 H20.3 H21.3 H22.1 LED1.3(VSS) LED3.3(VSS) LED4.3(VSS) LED5.3(VSS) LED6.3(VSS) LED7.3(VSS) LED8.3(VSS) LED9.3(VSS) LED10.3(VSS) LED11.3(VSS) LED12.3(VSS) LED13.3(VSS) LED14.3(VSS) LED15.3(VSS) LED16.3(VSS) LED17.3(VSS) LED18.3(VSS) LED19.3(VSS) LED20.3(VSS) LED21.3(VSS) LED22.3(VSS) LED23.3(VSS) LED24.3(VSS) LED25.3(VSS) LED26.3(VSS) LED27.3(VSS) LED28.3(VSS) LED29.3(VSS) LED30.3(VSS) LED31.3(VSS) LED32.3(VSS) LED33.3(VSS) LED34.3(VSS) LED35.3(VSS) LED36.3(VSS) LED37.3(VSS) LED38.3(VSS) LED39.3(VSS) LED40.3(VSS) LED41.3(VSS) LED42.3(VSS) LED43.3(VSS) LED44.3(VSS) LED45.3(VSS) LED46.3(VSS) LED47.3(VSS) LED48.3(VSS) LED49.3(VSS) LED50.3(VSS) LED51.3(VSS) LED52.3(VSS) LED53.3(VSS) LED54.3(VSS) LED55.3(VSS) LED56.3(VSS) LED57.3(VSS) LED58.3(VSS) LED59.3(VSS) LED60.3(VSS) LED61.3(VSS) LED62.3(VSS) LED63.3(VSS) LED64.3(VSS) LED65.3(VSS) LED66.3(VSS) LED67.3(VSS) LED68.3(VSS) LED69.3(VSS) LED70.3(VSS) LED71.3(VSS) LED72.3(VSS) LED73.3(VSS) LED74.3(VSS) LED75.3(VSS) LED76.3(VSS) LED77.3(VSS) LED78.3(VSS) LED79.3(VSS) LED80.3(VSS) LED81.3(VSS) LED82.3(VSS) LED83.3(VSS) LED84.3(VSS) LED85.3(VSS) LED86.3(VSS) LED87.3(VSS) LED88.3(VSS) LED89.3(VSS) LED90.3(VSS) LED91.3(VSS) LED92.3(VSS) LED93.3(VSS) LED94.3(VSS) LED95.3(VSS) LED96.3(VSS) LED97.3(VSS) LED98.3(VSS) LED99.3(VSS) LED100.3(VSS) LED101.3(VSS) LED102.3(VSS) LED103.3(VSS) LED104.3(VSS) LED105.3(VSS) LED106.3(VSS) LED107.3(VSS) LED108.3(VSS) LED109.3(VSS) LED110.3(VSS) LED111.3(VSS) LED112.3(VSS) LED113.3(VSS) LED114.3(VSS) LED115.3(VSS) LED116.1(-) P1.5 P2.1 QBOOT.4 QU1.19(TESTEN) QU1.57(GND) QU2.4(GND) QX1.2(GND) QX1.4(GND) R1.2 R16.1 R17.1 R19.1 R23.1 RPRST.4 RPUSB.4 RPUSB1.4 U1.3(GND) U2.1(GND) U3.5(VSS) U4.4(VSS) U5.9(GND) U6.2(A0) U6.3(A1) U6.4(A2) U6.9(GND) U6.17(EP) U7.2(GND) U8.3(GND) U9.3(GND) U10.3(GND) U11.3(GND) U12.8(GND) U12.11(EP) USB1.A1(GND) USB1.A12(GND) USB1.B1(GND) USB1.B12(GND)
VCC: C3.1 C4.1 C6.2 C9.1 C10.2 C125.2 C126.2 C127.2 C128.2 C129.1 C130.1 C131.2 C132.2 C133.2 C136.1 C139.2 H21.2 JP1.1 JP3.2 P1.1 P2.2 QU1.1(IOVDD) QU1.10(IOVDD) QU1.22(IOVDD) QU1.33(IOVDD) QU1.42(IOVDD) QU1.43(ADC_AVDD) QU1.44(VREG_IN) QU1.48(USB_VDD) QU1.49(IOVDD) QU2.8(VCC) R2.2 R3.1 R4.1 R5.2 R6.2 R8.2 R14.1 R15.1 R18.2 R20.2 R21.2 R22.2 R24.2 R25.1 U1.1(VCC) U2.2(Out) U3.10(VDD) U4.8(VCC) U5.8(VCC) U6.1(VCC) U7.6(VCCB) U8.1(VCC) U9.1(VCC) U10.1(VCC) U11.1(VCC)
ADC0: QU1.38(GPIO26_ADC0)
ADC1: QU1.39(GPIO27_ADC1)
ADC2: QU1.40(GPIO28_ADC2)
ADC3: QU1.41(GPIO29_ADC3)
GPIO 0: JP11.2 QU1.2(GPIO0)
GPIO 1: JP10.2 QU1.3(GPIO1)
GPIO 2: H22.2 JP12.2 QU1.4(GPIO2) R3.2 U1.4(SDA) U3.6(SDA) U4.5(SDA)
GPIO 3: H22.3 JP13.2 QU1.5(GPIO3) R4.2 U1.6(SCL) U3.7(SCL) U4.6(SCL)
GPIO 4: QU1.6(GPIO4)
GPIO 5: JP14.2 QU1.7(GPIO5)
GPIO 6: JP15.2 QU1.8(GPIO6)
GPIO 7: QU1.9(GPIO7)
GPIO 8: QU1.11(GPIO8)
GPIO 9: QU1.12(GPIO9)
GPIO 10: QU1.13(GPIO10)
GPIO 11: QU1.14(GPIO11)
GPIO 12: QU1.15(GPIO12)
GPIO 13: QU1.16(GPIO13)
GPIO 14: QU1.17(GPIO14)
GPIO 15: QU1.18(GPIO15)
GPIO 16: JP7.1 QU1.27(GPIO16)
GPIO 17: QU1.28(GPIO17)
GPIO 18: QU1.29(GPIO18)
GPIO 19: QU1.30(GPIO19)
GPIO 20: QU1.31(GPIO20)
GPIO 21: QU1.32(GPIO21)
GPIO 22: JP6.1 QU1.34(GPIO22)
GPIO 23: QU1.35(GPIO23)
GPIO 24: QU1.36(GPIO24)
GPIO 25: QU1.37(GPIO25) R13.1
MATRIX_DIN: H2.2 LED8.4(DIN) LED115.2(DOUT)
PCF_P4: R24.1 U6.10(P4) U12.4(#ACK)
QSPI_CLK: QU1.52(QSPI_SCLK) QU2.6(CLK)
QSPI_SD0: QU1.53(QSPI_SD0) QU2.5(DI(IO0))
QSPI_SD1: QU1.55(QSPI_SD1) QU2.2(DO(IO1))
QSPI_SD2: QU1.54(QSPI_SD2) QU2.3(WP#(IO2))
QSPI_SD3: QU1.51(QSPI_SD3) QU2.7(HOLD# or RESET#(IO3))
QSPI_SS: QU1.56(QSPI_SS) QU2.1(CS#) R11.1 R12.2
RUN: P1.2 QU1.26(RUN) R5.1 RPRST.2
SWCLK: P1.4 QU1.24(SWCLK)
SWD: P1.3 QU1.25(SWD)
USB_D+: JP19.2 R7.2 RPUSB.3
USB_D+C: JP17.1 RPUSB1.3 U12.7(D+) USB1.A6(Dp1) USB1.B6(Dp2)
USB_D-: JP18.2 R9.2 RPUSB.2
USB_D-C: JP16.1 RPUSB1.2 U12.6(D-) USB1.A7(Dn1) USB1.B7(Dn2)
USB_VBUS: C137.1 JP5.2 RPUSB1.1 U12.9(VBUS) U12.10(VBUS) USB1.A4(VBUS) USB1.B9(VBUS)
XIN: C134.1 QU1.20(XIN) QX1.1(OSC1)
XOUT: C135.2 QU1.21(XOUT) QX1.3(OSC2)
Net-(BT1-1): BT1.1 BT2.1 U3.3(VBAT)
Net-(C7-1): C7.1 R2.1 U1.5(DVI)
Net-(C122-1): C122.1 D1.1(C) JP4.2 LED115.1(VDD)
Net-(ESPFLASH-2): ESPFLASH.2 ESPRST.1
Net-(ESPFLASH-3): ESPFLASH.3 JP15.1
Net-(ESPFLASH-4): ESPFLASH.4 R14.2 U5.12(GPIO0)
Net-(ESPRST-3): ESPRST.3 JP14.1 P2.5 R6.1 U5.1(RST) U5.4(GPIO16)
Net-(H1-2): H1.2 H5.2 LED4.2(DOUT) LED25.4(DIN)
Net-(H3-2): H3.2 LED3.2(DOUT) LED114.4(DIN)
Net-(H4-2): H4.2 LED22.4(DIN) LED114.2(DOUT)
Net-(H6-2): H6.2 H8.2 LED34.2(DOUT) LED44.4(DIN)
Net-(H7-2): H7.2 H9.2 LED35.2(DOUT) LED47.4(DIN)
Net-(H10-2): H10.2 H12.2 LED56.2(DOUT) LED66.4(DIN)
Net-(H11-2): H11.2 H13.2 LED57.2(DOUT) LED69.4(DIN)
Net-(H14-2): H14.2 H16.2 LED78.2(DOUT) LED88.4(DIN)
Net-(H15-2): H15.2 H17.2 LED79.2(DOUT) LED91.4(DIN)
Net-(H18-2): H18.2 LED100.2(DOUT) LED113.4(DIN)
Net-(H19-2): H19.2 LED101.2(DOUT) LED112.4(DIN)
Net-(H20-2): H20.2 LED110.4(DIN) LED113.2(DOUT)
Net-(JP1-2): JP1.2 U7.5(OE)
Net-(JP2-1): JP2.1 U6.16(SDA)
Net-(JP2-2): JP2.2 JP12.1
Net-(JP3-1): JP3.1 R12.1
Net-(JP6-2): JP6.2 JP7.2 JP8.2 U7.4(B)
Net-(JP8-1): JP8.1 R10.2 U7.3(A)
Net-(JP9-1): JP9.1 U6.15(SCL)
Net-(JP9-2): JP9.2 JP13.1
Net-(JP10-1): JP10.1 P2.4 U5.16(TXD0)
Net-(JP11-1): JP11.1 P2.3 U5.15(RXD0)
Net-(JP16-2): JP16.2 JP18.1
Net-(JP17-2): JP17.2 JP19.1
Net-(LED1-2): LED1.2(DOUT) LED3.4(DIN)
Net-(LED1-4): LED1.4(DIN) LED16.2(DOUT)
Net-(LED2-1): LED2.1(-) U6.13(P7)
Net-(LED2-2): LED2.2(+) R25.2
Net-(LED4-4): LED4.4(DIN) LED23.2(DOUT)
Net-(LED5-2): LED5.2(DOUT) LED23.4(DIN)
Net-(LED5-4): LED5.4(DIN) LED17.2(DOUT)
Net-(LED6-2): LED6.2(DOUT) LED7.4(DIN)
Net-(LED6-4): LED6.4(DIN) LED18.2(DOUT)
Net-(LED7-2): LED7.2(DOUT) LED17.4(DIN)
Net-(LED8-2): LED8.2(DOUT) LED9.4(DIN)
Net-(LED9-2): LED9.2(DOUT) LED10.4(DIN)
Net-(LED10-2): LED10.2(DOUT) LED11.4(DIN)
Net-(LED11-2): LED11.2(DOUT) LED12.4(DIN)
Net-(LED12-2): LED12.2(DOUT) LED15.4(DIN)
Net-(LED13-2): LED13.2(DOUT) LED16.4(DIN)
Net-(LED13-4): LED13.4(DIN) LED14.2(DOUT)
Net-(LED14-4): LED14.4(DIN) LED15.2(DOUT)
Net-(LED18-4): LED18.4(DIN) LED19.2(DOUT)
Net-(LED19-4): LED19.4(DIN) LED20.2(DOUT)
Net-(LED20-4): LED20.4(DIN) LED21.2(DOUT)
Net-(LED21-4): LED21.4(DIN) LED22.2(DOUT)
Net-(LED24-2): LED24.2(DOUT) LED34.4(DIN)
Net-(LED24-4): LED24.4(DIN) LED33.2(DOUT)
Net-(LED25-2): LED25.2(DOUT) LED26.4(DIN)
Net-(LED26-2): LED26.2(DOUT) LED27.4(DIN)
Net-(LED27-2): LED27.2(DOUT) LED28.4(DIN)
Net-(LED28-2): LED28.2(DOUT) LED29.4(DIN)
Net-(LED29-2): LED29.2(DOUT) LED32.4(DIN)
Net-(LED30-2): LED30.2(DOUT) LED33.4(DIN)
Net-(LED30-4): LED30.4(DIN) LED31.2(DOUT)
Net-(LED31-4): LED31.4(DIN) LED32.2(DOUT)
Net-(LED35-4): LED35.4(DIN) LED45.2(DOUT)
Net-(LED36-2): LED36.2(DOUT) LED45.4(DIN)
Net-(LED36-4): LED36.4(DIN) LED39.2(DOUT)
Net-(LED37-2): LED37.2(DOUT) LED38.4(DIN)
Net-(LED37-4): LED37.4(DIN) LED40.2(DOUT)
Net-(LED38-2): LED38.2(DOUT) LED39.4(DIN)
Net-(LED40-4): LED40.4(DIN) LED41.2(DOUT)
Net-(LED41-4): LED41.4(DIN) LED42.2(DOUT)
Net-(LED42-4): LED42.4(DIN) LED43.2(DOUT)
Net-(LED43-4): LED43.4(DIN) LED44.2(DOUT)
Net-(LED46-2): LED46.2(DOUT) LED56.4(DIN)
Net-(LED46-4): LED46.4(DIN) LED55.2(DOUT)
Net-(LED47-2): LED47.2(DOUT) LED48.4(DIN)
Net-(LED48-2): LED48.2(DOUT) LED49.4(DIN)
Net-(LED49-2): LED49.2(DOUT) LED50.4(DIN)
Net-(LED50-2): LED50.2(DOUT) LED51.4(DIN)
Net-(LED51-2): LED51.2(DOUT) LED54.4(DIN)
Net-(LED52-2): LED52.2(DOUT) LED55.4(DIN)
Net-(LED52-4): LED52.4(DIN) LED53.2(DOUT)
Net-(LED53-4): LED53.4(DIN) LED54.2(DOUT)
Net-(LED57-4): LED57.4(DIN) LED67.2(DOUT)
Net-(LED58-2): LED58.2(DOUT) LED67.4(DIN)
Net-(LED58-4): LED58.4(DIN) LED61.2(DOUT)
Net-(LED59-2): LED59.2(DOUT) LED60.4(DIN)
Net-(LED59-4): LED59.4(DIN) LED62.2(DOUT)
Net-(LED60-2): LED60.2(DOUT) LED61.4(DIN)
Net-(LED62-4): LED62.4(DIN) LED63.2(DOUT)
Net-(LED63-4): LED63.4(DIN) LED64.2(DOUT)
Net-(LED64-4): LED64.4(DIN) LED65.2(DOUT)
Net-(LED65-4): LED65.4(DIN) LED66.2(DOUT)
Net-(LED68-2): LED68.2(DOUT) LED78.4(DIN)
Net-(LED68-4): LED68.4(DIN) LED77.2(DOUT)
Net-(LED69-2): LED69.2(DOUT) LED70.4(DIN)
Net-(LED70-2): LED70.2(DOUT) LED71.4(DIN)
Net-(LED71-2): LED71.2(DOUT) LED72.4(DIN)
Net-(LED72-2): LED72.2(DOUT) LED73.4(DIN)
Net-(LED73-2): LED73.2(DOUT) LED76.4(DIN)
Net-(LED74-2): LED74.2(DOUT) LED77.4(DIN)
Net-(LED74-4): LED74.4(DIN) LED75.2(DOUT)
Net-(LED75-4): LED75.4(DIN) LED76.2(DOUT)
Net-(LED79-4): LED79.4(DIN) LED89.2(DOUT)
Net-(LED80-2): LED80.2(DOUT) LED89.4(DIN)
Net-(LED80-4): LED80.4(DIN) LED83.2(DOUT)
Net-(LED81-2): LED81.2(DOUT) LED82.4(DIN)
Net-(LED81-4): LED81.4(DIN) LED84.2(DOUT)
Net-(LED82-2): LED82.2(DOUT) LED83.4(DIN)
Net-(LED84-4): LED84.4(DIN) LED85.2(DOUT)
Net-(LED85-4): LED85.4(DIN) LED86.2(DOUT)
Net-(LED86-4): LED86.4(DIN) LED87.2(DOUT)
Net-(LED87-4): LED87.4(DIN) LED88.2(DOUT)
Net-(LED90-2): LED90.2(DOUT) LED100.4(DIN)
Net-(LED90-4): LED90.4(DIN) LED99.2(DOUT)
Net-(LED91-2): LED91.2(DOUT) LED92.4(DIN)
Net-(LED92-2): LED92.2(DOUT) LED93.4(DIN)
Net-(LED93-2): LED93.2(DOUT) LED94.4(DIN)
Net-(LED94-2): LED94.2(DOUT) LED95.4(DIN)
Net-(LED95-2): LED95.2(DOUT) LED98.4(DIN)
Net-(LED96-2): LED96.2(DOUT) LED99.4(DIN)
Net-(LED96-4): LED96.4(DIN) LED97.2(DOUT)
Net-(LED97-4): LED97.4(DIN) LED98.2(DOUT)
Net-(LED101-4): LED101.4(DIN) LED111.2(DOUT)
Net-(LED102-2): LED102.2(DOUT) LED111.4(DIN)
Net-(LED102-4): LED102.4(DIN) LED105.2(DOUT)
Net-(LED103-2): LED103.2(DOUT) LED104.4(DIN)
Net-(LED103-4): LED103.4(DIN) LED106.2(DOUT)
Net-(LED104-2): LED104.2(DOUT) LED105.4(DIN)
Net-(LED106-4): LED106.4(DIN) LED107.2(DOUT)
Net-(LED107-4): LED107.4(DIN) LED108.2(DOUT)
Net-(LED108-4): LED108.4(DIN) LED109.2(DOUT)
Net-(LED109-4): LED109.4(DIN) LED110.2(DOUT)
Net-(LED116-2): LED116.2(+) R13.2
Net-(P3-1): P3.1 QBOOT.3
Net-(P3-2): P3.2 QBOOT.1
Net-(PWRRST-4): PWRRST.4 R23.2 U12.3(#EN)
Net-(QBOOT-2): QBOOT.2 R11.2
Net-(QU1-46): QU1.46(USB_DM) R9.1
Net-(QU1-47): QU1.47(USB_DP) R7.1
Net-(R1-1): R1.1 U1.2(ADDR)
Net-(R8-1): R8.1 U5.3(EN)
Net-(R15-2): R15.2 U5.11(GPIO2)
Net-(R16-2): R16.2 U5.10(GPIO15)
Net-(R17-2): R17.2 USB1.A5(CC1)
Net-(R18-1): R18.1 U6.8(P3) U8.2(VOUT)
Net-(R19-2): R19.2 USB1.B5(CC2)
Net-(R20-1): R20.1 U6.7(P2) U9.2(VOUT)
Net-(R21-1): R21.1 U6.6(P1) U10.2(VOUT)
Net-(R22-1): R22.1 U6.5(P0) U11.2(VOUT)
Net-(U3-1): U3.1(OSCI) X1.1(OSC1)
Net-(U3-2): U3.2(OSCO) X1.2(OSC2)

Not connected (* = marked no-connect by the designer): ESPFLASH 1*; ESPRST 4*; LED112 2(DOUT); PWRRST 1* 3*; QU2 9(EP); RPRST 1* 3*; U1 7(EP)*; U2 4(TAB); U3 4(TS(CLK/INTB)#)* 8(CLK)* 9(INTA#(CLK))* 11(EP)*; U4 1(E1)* 2(E2)* 3(E3)* 7(WC#)*; U5 2(ADC) 5(GPIO14) 6(GPIO12) 7(GPIO13) 13(GPIO4) 14(GPIO5) 17(CS0) 18(MISO) 19(GPIO9) 20(GPIO10) 21(MOSI) 22(SCLK); U6 11(P5)* 12(P6)* 14(INT#)*; U12 5(ID)*; USB1 17(EH)* 18(EH)* 19(EH) 20(EH) A8(SBU1) A9(VBUS) B4(VBUS) B8(SBU2)
